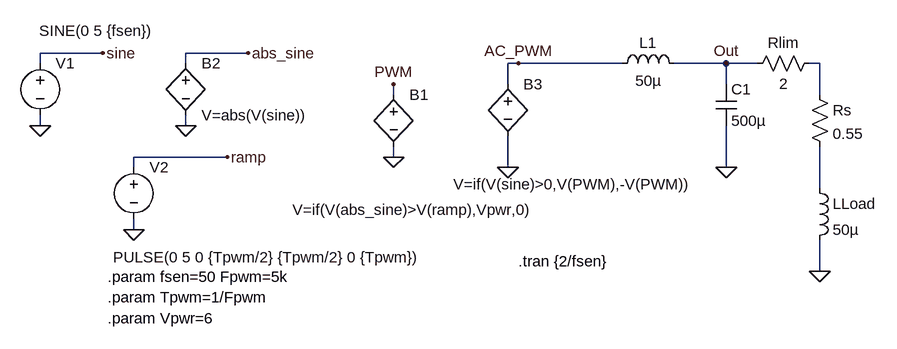
[diagram p0: schematic sPWM_AC_LLoad.asc]
sPWM_AC_LLoad.asc, the LTspice schematic file:
Version 4
SHEET 1 1264 680
WIRE 32 32 -64 32
WIRE 256 32 160 32
WIRE -64 48 -64 32
WIRE 160 48 160 32
WIRE 672 48 656 48
WIRE 832 48 672 48
WIRE 992 48 912 48
WIRE 1040 48 992 48
WIRE 1136 48 1120 48
WIRE 656 80 656 48
WIRE 992 80 992 48
WIRE 480 96 480 80
WIRE 1136 96 1136 48
WIRE -64 144 -64 128
WIRE 160 144 160 128
WIRE 224 192 80 192
WIRE 480 192 480 176
WIRE 80 208 80 192
WIRE 656 208 656 160
WIRE 992 208 992 144
WIRE 1136 240 1136 176
WIRE 80 304 80 288
WIRE 1136 368 1136 320
FLAG -64 144 0
FLAG 80 304 0
FLAG 32 32 sine
FLAG 224 192 ramp
FLAG 480 192 0
FLAG 992 208 0
FLAG 1136 368 0
FLAG 480 80 PWM
FLAG 160 144 0
FLAG 256 32 abs_sine
FLAG 656 208 0
FLAG 672 48 AC_PWM
FLAG 992 48 Out
SYMBOL voltage -64 32 R0
WINDOW 3 -2 -34 Left 2
WINDOW 123 0 0 Left 2
WINDOW 39 0 0 Left 2
SYMATTR Value SINE(0 5 {fsen})
SYMATTR InstName V1
SYMBOL voltage 80 192 R0
WINDOW 3 -32 154 Left 2
WINDOW 123 0 0 Left 2
WINDOW 39 0 0 Left 2
SYMATTR Value PULSE(0 5 0 {Tpwm/2} {Tpwm/2} 0 {Tpwm})
SYMATTR InstName V2
SYMBOL bv 480 80 R0
WINDOW 3 -156 193 Left 2
SYMATTR Value V=if(V(abs_sine)>V(ramp),Vpwr,0)
SYMATTR InstName B1
SYMBOL cap 976 80 R0
SYMATTR InstName C1
SYMATTR Value 500µ
SYMBOL bv 160 32 R0
SYMATTR InstName B2
SYMATTR Value V=abs(V(sine))
SYMBOL bv 656 64 R0
WINDOW 3 -84 170 Left 2
SYMATTR Value V=if(V(sine)>0,V(PWM),-V(PWM))
SYMATTR InstName B3
SYMBOL ind 816 64 R270
WINDOW 0 32 56 VTop 2
WINDOW 3 5 56 VBottom 2
SYMATTR InstName L1
SYMATTR Value 50µ
SYMBOL ind 1120 224 R0
SYMATTR InstName LLoad
SYMATTR Value 50µ
SYMBOL res 1136 32 R90
WINDOW 0 0 56 VBottom 2
WINDOW 3 32 56 VTop 2
SYMATTR InstName Rlim
SYMATTR Value 2
SYMBOL res 1120 80 R0
SYMATTR InstName Rs
SYMATTR Value 0.55
TEXT 672 352 Left 2 !.tran {2/fsen}
TEXT 40 376 Left 2 !.param fsen=50 Fpwm=5k
TEXT 40 408 Left 2 !.param Tpwm=1/Fpwm
TEXT 40 440 Left 2 !.param Vpwr=6

The netlist it stands for:
* sPWM_AC_LLoad.asc
V1 sine 0 SINE(0 5 {fsen})
V2 ramp 0 PULSE(0 5 0 {Tpwm/2} {Tpwm/2} 0 {Tpwm})
B1 PWM 0 V=if(V(abs_sine)>V(ramp),Vpwr,0)
C1 Out 0 500µ
B2 abs_sine 0 V=abs(V(sine))
B3 AC_PWM 0 V=if(V(sine)>0,V(PWM),-V(PWM))
L1 AC_PWM Out 50µ
LLoad N002 0 50µ
Rlim N001 Out 2
Rs N001 N002 0.55
.tran {2/fsen}
.param fsen=50 Fpwm=5k
.param Tpwm=1/Fpwm
.param Vpwr=6
.backanno
.end

* Results of the author's LTspice run, read from the files saved beside the schematic
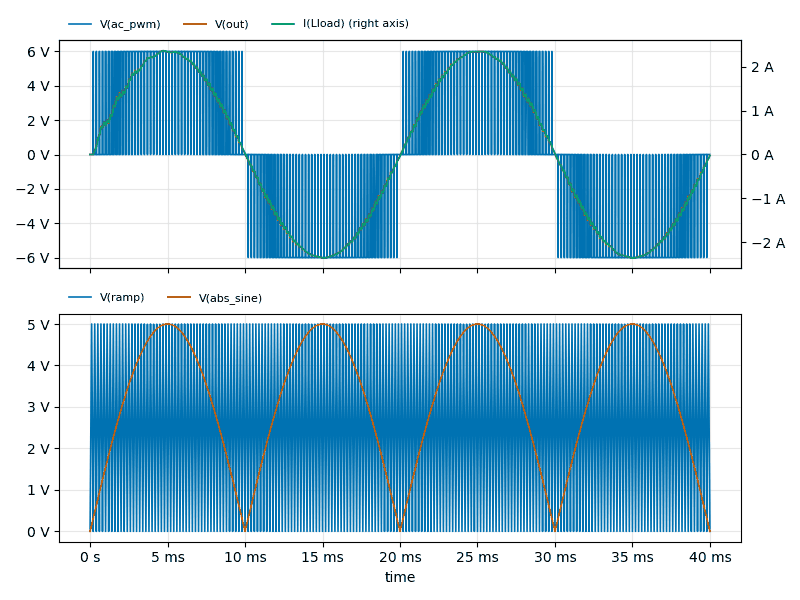
[diagram p1: Transient Analysis of sPWM_AC_LLoad.asc, plotted from the saved traces]
* Transient Analysis, 1 run:
*   V(ac_pwm): min -6 V, max 6 V, average 3.53 mV, rms 4.778 V, last 0 V
*   V(out): min -6.031 V, max 6.045 V, average -1.443 mV, rms 4.252 V, last -39.98 mV
*   I(Lload): min -2.364 A, max 2.369 A, average -547.2 µA, rms 1.667 A, last -31.75 mA
*   V(ramp): min 0 V, max 5 V, average 2.5 V, rms 2.915 V, last 0 V
*   V(abs_sine): min 0 V, max 5 V, average 3.183 V, rms 3.536 V, last 0 V